# Altium schematic sheet Clockgen.SchDoc
size C; SheetNumber: 5; SheetTotal: 5
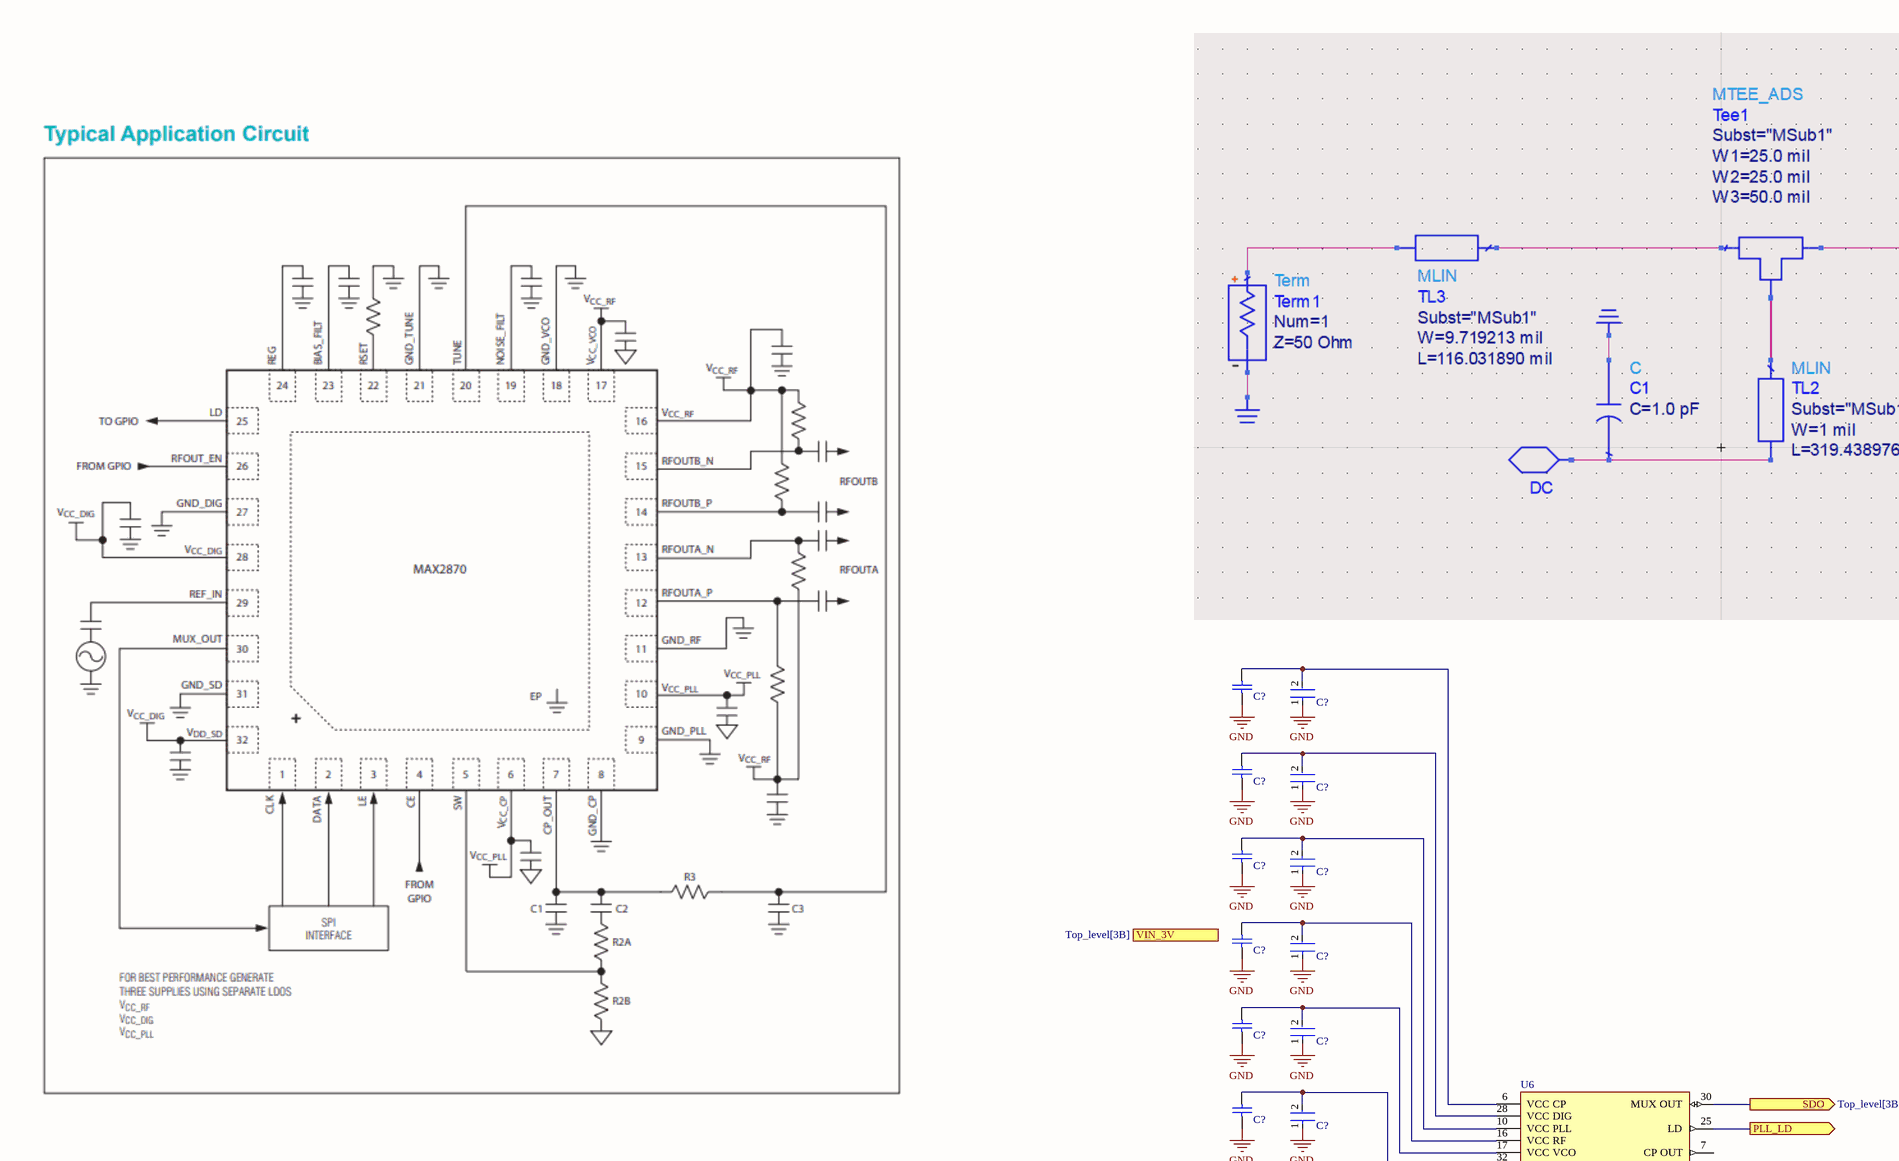
[diagram p0: Clockgen.SchDoc, top left]
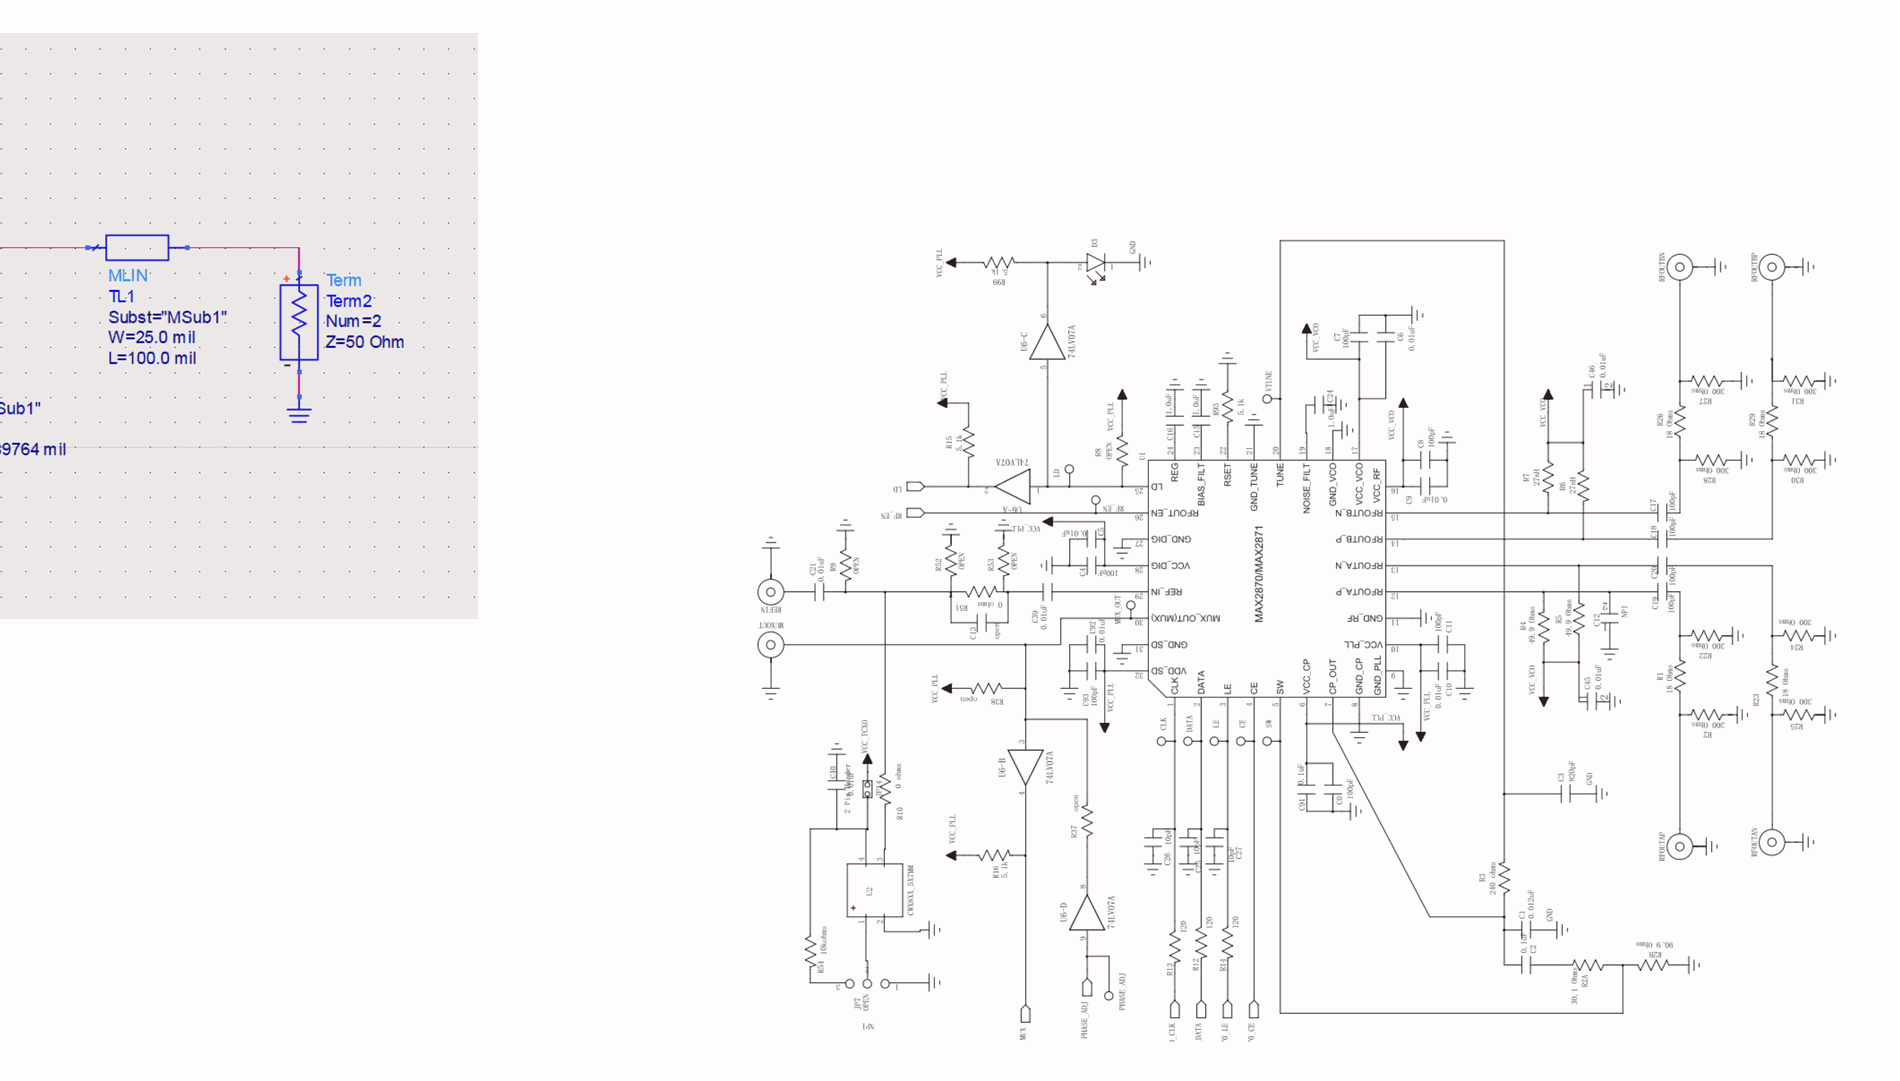
[diagram p1: Clockgen.SchDoc, top right]
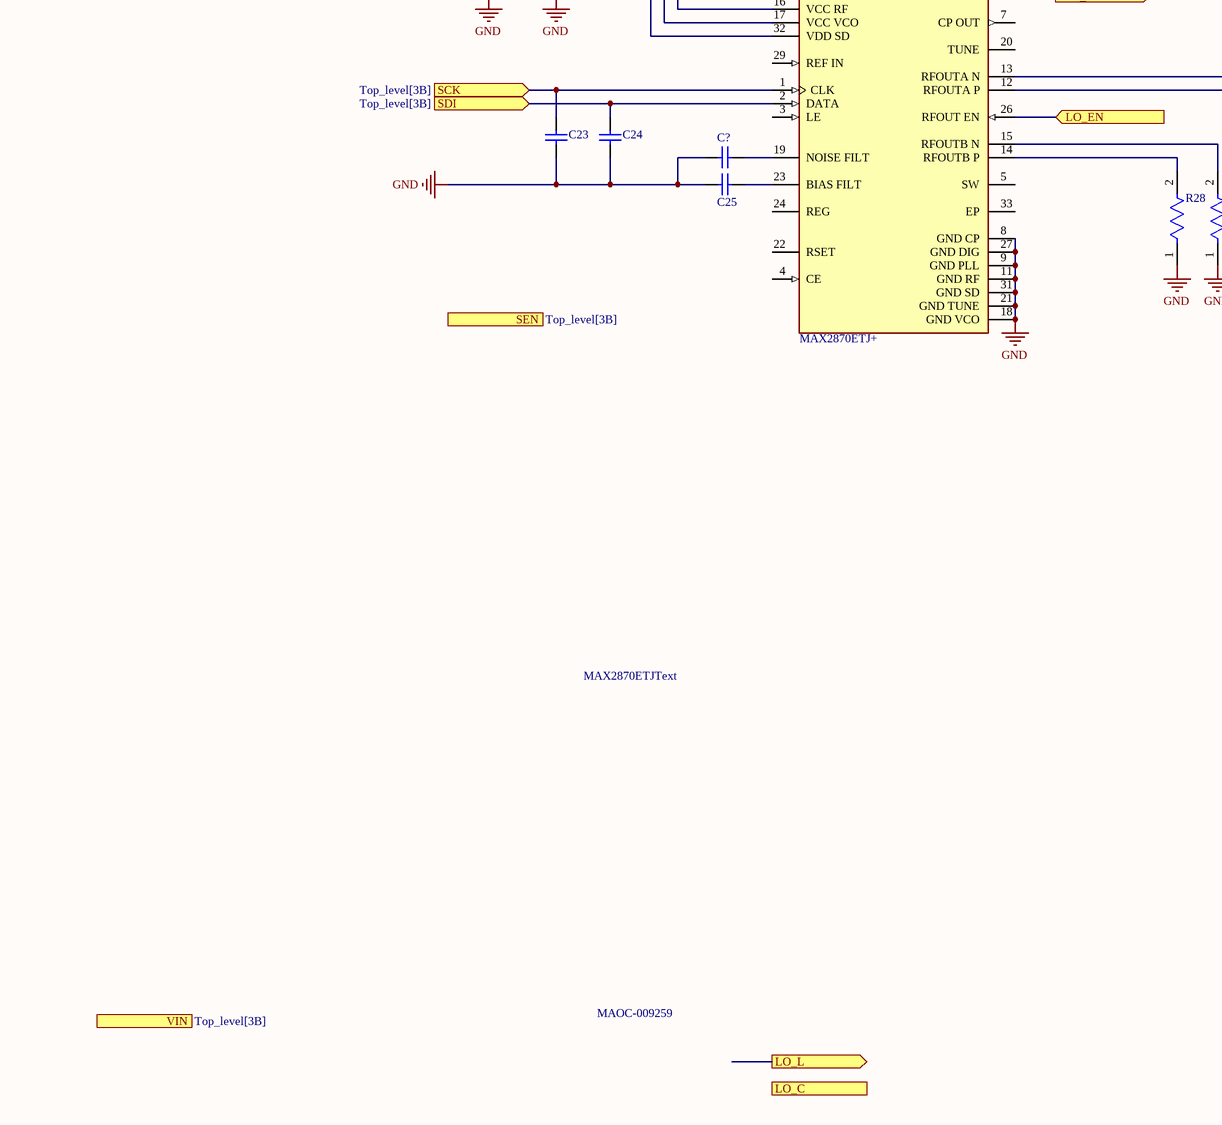
[diagram p2: Clockgen.SchDoc, bottom left]
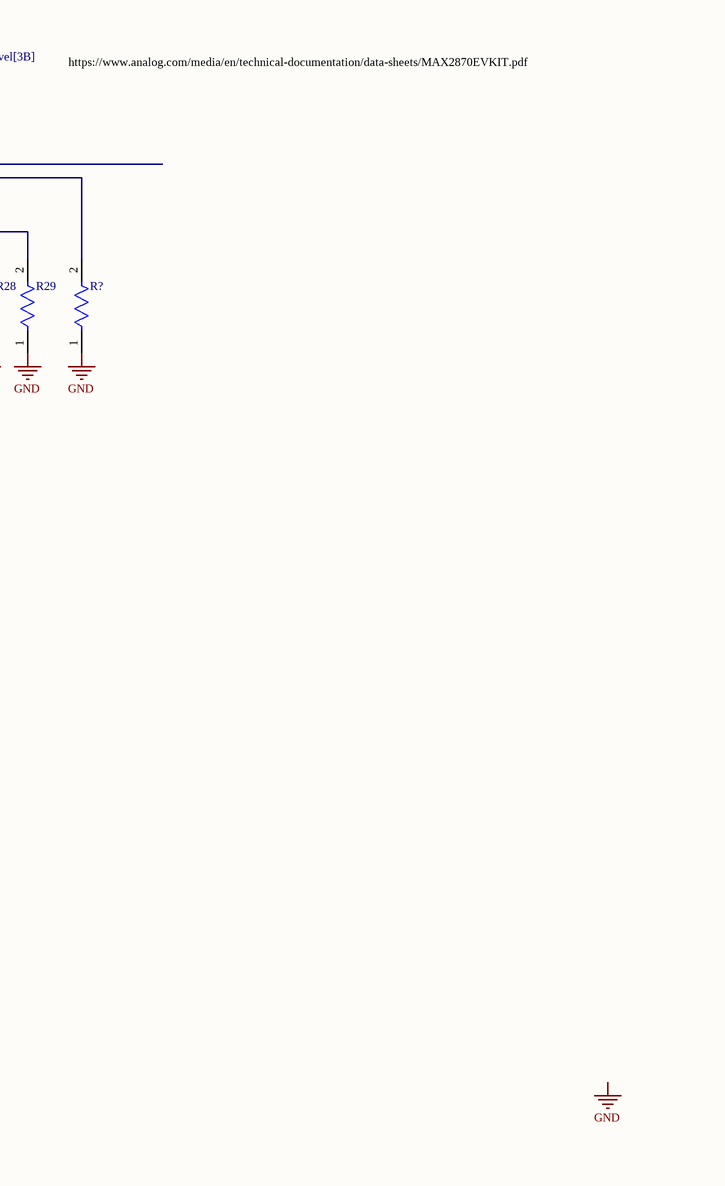
[diagram p3: Clockgen.SchDoc, bottom right]

## Parts
(Parts that share a designator on the sheet are numbered #1, #2 ... from top to bottom, then left to right.)
C23  GRM1885C1H100JA01D  [CAPC1608X90X35LL10T15]  (value not drawn)
C24  GRM1885C1H100JA01D  [CAPC1608X90X35LL10T15]  (value not drawn)
C25  C0805C105K4PACTU  [CAPC2013X145X50LL20T25]  (value not drawn)
C?#1  CC0603JRNPO9BN101  [CAPC1608X90X40ML10T20]  (value not drawn)
C?#2  C0603C103M4RACAUTO  [FP-C0603C-CF-MFG]  (value not drawn)
C?#3  CC0603JRNPO9BN101  [CAPC1608X90X40ML10T20]  (value not drawn)
C?#4  C0603C103M4RACAUTO  [FP-C0603C-CF-MFG]  (value not drawn)
C?#5  CC0603JRNPO9BN101  [CAPC1608X90X40ML10T20]  (value not drawn)
C?#6  C0603C103M4RACAUTO  [FP-C0603C-CF-MFG]  (value not drawn)
C?#7  CC0603JRNPO9BN101  [CAPC1608X90X40ML10T20]  (value not drawn)
C?#8  C0603C103M4RACAUTO  [FP-C0603C-CF-MFG]  (value not drawn)
C?#9  CC0603JRNPO9BN101  [CAPC1608X90X40ML10T20]  (value not drawn)
C?#10  C0603C103M4RACAUTO  [FP-C0603C-CF-MFG]  (value not drawn)
C?#11  CC0603JRNPO9BN101  [CAPC1608X90X40ML10T20]  (value not drawn)
C?#12  C0603C103M4RACAUTO  [FP-C0603C-CF-MFG]  (value not drawn)
C?#13  C0603C105K4RACTU  [CAPC1608X90X35LL15T15]  (value not drawn)
R28  CRCW060350R0FKEA  [FP-CRCW0603-e3-MFG]  (value not drawn)
R29  CRCW060350R0FKEA  [FP-CRCW0603-e3-MFG]  (value not drawn)
R?  CRCW060350R0FKEA  [FP-CRCW0603-e3-MFG]  (value not drawn)
U6  MAX2870ETJ+  [FP-T3255-5-MFG]

## Ports
LO_C (out), LO_EN (in), LO_L (out), PLL_LD (out), SCK (in, see Top_level[3B]), SDI (in, see Top_level[3B]), SDO (out, see Top_level[3B]), SEN (in, see Top_level[3B]), VIN (see Top_level[3B]), VIN_3V (see Top_level[3B])

## Nets
GND: C23.1 C24.1 C25.1 C?#1.1 C?#2.1 C?#3.1 C?#4.1 C?#5.1 C?#6.1 C?#7.1 C?#8.1 C?#9.1 C?#10.1 C?#11.1 C?#12.1 C?#13.1 R28.1 R29.1 R?.1 U6.8(GND_CP) U6.9(GND_PLL) U6.11(GND_RF) U6.18(GND_VCO) U6.21(GND_TUNE) U6.27(GND_DIG) U6.31(GND_SD)
LO_EN: U6.26(RFOUT_EN) ; port LO_EN
PLL_LD: U6.25(LD) ; port PLL_LD
SCK: C23.2 U6.1(CLK) ; port SCK
SDI: C24.2 U6.2(DATA) ; port SDI
SDO: U6.30(MUX_OUT) ; port SDO
NetC25_2: C25.2 U6.23(BIAS_FILT)
NetC?#1_2: C?#1.2 C?#2.2 U6.6(VCC_CP)
NetC?#3_2: C?#3.2 C?#4.2 U6.28(VCC_DIG)
NetC?#5_2: C?#5.2 C?#6.2 U6.10(VCC_PLL)
NetC?#7_2: C?#7.2 C?#8.2 U6.16(VCC_RF)
NetC?#9_2: C?#9.2 C?#10.2 U6.17(VCC_VCO)
NetC?#11_2: C?#11.2 C?#12.2 U6.32(VDD_SD)
NetC?#13_2: C?#13.2 U6.19(NOISE_FILT)
NetR28_2: R28.2 U6.14(RFOUTB_P)
NetR29_2: R29.2 U6.15(RFOUTB_N)
NetR?_2: R?.2 U6.12(RFOUTA_P)

Not connected (* = marked no-connect by the designer): U6 3(LE) 4(CE) 5(SW) 7(CP_OUT) 13(RFOUTA_N) 20(TUNE) 22(RSET) 24(REG) 29(REF_IN) 33(EP)

## Notes on the sheet
- https://www.analog.com/media/en/technical-documentation/data-sheets/MAX2870EVKIT.pdf
- MAX2870ETJText
- MAOC-009259
- Labels drawn without touching a wire or pin: GND

## Library data of the parts
C23 C24 = CMP-2006-02592-1: Manufacturer: Murata; Part Number: GRM1885C1H100JA01D
C25 = CMP-1036-04746-2: Manufacturer: Kemet; Part Number: C0805C105K4PACTU
C?#1 C?#3 C?#5 C?#7 C?#9 C?#11 = CMP-2100-03594-1: Chip Capacitor, 100 pF, +/- 5%, 50 V, -55 to 125 degC, 0603 (1608 Metric), RoHS, Tape and Reel; Manufacturer: Yageo; Capacitance: 100pF; Voltage Rating (DC): 50V; Dielectric: C0G; Temperature Coefficient: 30ppm/degC; Insulation Resistance: 100GR; Datasheet Version: Rev. 14, 07/2016; Manufacturer URL: http://www.yageo.com/; Packaging: TapeandReel; Mount: SurfaceMount; RoHSCompliant: True; Package Reference: 0603; Tolerance: 5%; Max Operating Temperature: 125degC; Case Code (Imperial): 0603; Number of Pins: 2; Width: 0.8mm; Case Code (Metric): 1608; Voltage: 50V; REACH SVHC: Unknown; Package Description: 2-Pin Surface Mount Device, Body 1.6 x 0.8 mm; Composition: Ceramic; Lead Free: LeadFree; Min Operating Temperature: -55degC; Radiation Hardening: No; Depth: 0.8mm; Thickness: 0.035inch; Datasheet URL: http://www.yageo.com/documents/recent/UPY-GP_NP0_16V-to-50V_14.pdf; Termination: SMD/SMT; Package Quantity: 1; Length: 1.6mm; Voltage Rating: 50V; Height: 0.8mm; Case/Package: 0603
C?#2 C?#4 C?#6 C?#8 C?#10 C?#12 = CMP-03020-020209-2: CAP CER 0603 .01UF 16V X7R 20% A; Manufacturer: KEMET; Capacitance: 10,000 pF; Temperature Coefficient: 30ppm/°C; Automotive Grade: Grade 1; Material: Ceramic; Tolerance: 0.2; Value: 10,000 pF; Temperature Characteristic: X7R; RoHS: TRUE; ComponentLink2Description: Datasheet; Category: Cap; Digikey Description: CAP CER 0603 .01UF 16V X7R 20% A; Lead Free: Yes; Temperature Range Low: -55°C; Height: 0.87mm; Temperature Range High: +125°C; Octopart: https://octopart.com/c0603c103m4racauto-kemet-75357849; Voltage Rating: 16 V; ComponentLink2URL: https://api.kemet.com/component-edge/download/datasheet/C0603C100J5GACAUTO.pdf; Package: C0603C-CF; Manufacturer Part Number: C0603C103M4RACAUTO; Automotive: Yes; Device Class L1: Passive Components; Device Class L2: Capacitors; Temperature: -55°C to +125°C; Device Class L3: Ceramic Capacitors
C?#13 = CMP-2006-02298-2: Manufacturer: Kemet; Part Number: C0603C105K4RACTU
R28 R29 R? = CMP-2000-03436-2: RES Thick Film, 50Ω, 1%, 0.1W, 100ppm/°C, 0603; Voltage Rating (DC): 75V; Resistance: 50R; Power Rating: 100mW; Case/Package: 0603; Packaging: Tape and Reel; Military Standard: Not; REACH SVHC: No SVHC; Width: 0.85mm; Max Operating Temperature: 155°C; Case Code (Metric): 1608; Temperature Coefficient: 100ppm/°C; Lead Free: Lead Free; Height: 0.45mm; Composition: Thick Film; Termination: SMD/SMT; Contact Plating: Tin; Number of Pins: 2; Tolerance: 1%; Depth: 0.85mm; Weight: 7.1E-05oz; Min Operating Temperature: -55°C; Length: 1.55mm; Radiation Hardening: No; Voltage Rating: 75V; Case Code (Imperial): 0603; Package Quantity: 5000; Mount: Surface Mount
U6 = CMP-05660-000001-1: RF FRACT INTR N SYNTH VCO 32TQFN; Manufacturer: Maxim Integrated; Nominal Supply Current: 10-144mA; Max Supply Voltage: 3.6V; Max Junction Temp: +150°C; Max Frequency: 6000MHz; Interface: SPI; Min Supply Voltage: 3V; Pll: YES; Number Of Outputs: 2; Standoff Height: 0mm; Ipc Land Pattern Name: QFN50P500X500X75-32; Manufacturer Part Number: MAX2870ETJ+; Height: 0.8mm; Device Class L1: Integrated Circuits (ICs); Temperature Range High: +85°C; Temperature Range Low: -40°C; Package: T3255-5; Temperature: -40°C to +85°C; Device Class L2: Clock and Timing; Category: IC; Device Class L3: PLLs; ComponentLink2Description: Datasheet; Automotive: No; Octopart: https://octopart.com/max2870etj%2B-maxim+integrated-21136837; Mouser Description: Phase Locked Loops - PLL PLL/VCO; ComponentLink2URL: https://datasheets.maximintegrated.com/en/ds/MAX2870.pdf; RoHS: TRUE; Footprint Url: https://pdfserv.maximintegrated.com/land_patterns/90-0013.PDF; Lead Free: Yes; Digikey Description: RF FRACT INTR N SYNTH VCO 32TQFN